# Altium schematic sheet UART Comm Isolation.SchDoc: UART Isolation
size 292 x 193 mm; SheetNumber: 7; SheetTotal: 12
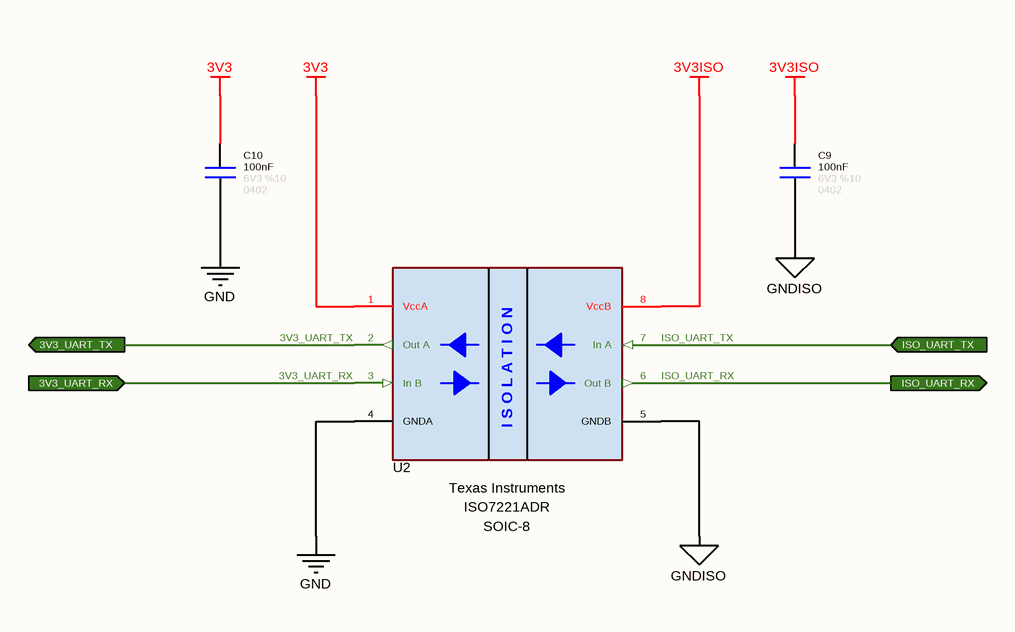
[diagram p0: UART Comm Isolation.SchDoc]

## Parts
C9  value 100nF  Tolerance: %10  Voltage: 6V3  Case: 0402  [CAPACITOR_0402]  (hidden comment: Capacitor - 100nF [0402] (Ceramic))
C10  value 100nF  Tolerance: %10  Voltage: 6V3  Case: 0402  [CAPACITOR_0402]  (hidden comment: Capacitor - 100nF [0402] (Ceramic))
U2  Manufacturer Name: Texas Instruments  Case: SOIC-8  [SOIC-8 Narrow]  (hidden comment: ISO7221ADR)

## Ports
3V3_UART_RX (in), 3V3_UART_TX (out), ISO_UART_RX (out), ISO_UART_TX (in)

## Nets
3V3: C10.2 U2.1(VccA)
3V3ISO: C9.2 U2.8(VccB)
GND: C10.1 U2.4(GNDA)
GNDISO: C9.1 U2.5(GNDB)
3V3_UART_RX: U2.3(In_B) ; port 3V3_UART_RX
3V3_UART_TX: U2.2(Out_A) ; port 3V3_UART_TX
ISO_UART_RX: U2.6(Out_B) ; port ISO_UART_RX
ISO_UART_TX: U2.7(In_A) ; port ISO_UART_TX

## Notes on the sheet
- © 2021 All rights reserved.
  This document may not, in whole or in part, be copied, photocopied, reproduced, translated or converted to any electronic or machine readable from without prior written permission of Mehmet Günce Akkoyun.
  Engineer contact : akkoyun@me.com
- Property of
- Engineer :
- Date :
- Size :
- A4
- Time :
- Project :
- Page :
- /
- Customer :
- Product ID :
- Module ID :
- Version :
- File :
- Revision :
- (in symbol IC - ISO7221ADR) I S O L A T I O N

## Library data of the parts
C9 C10 = Capacitor - 100nF [0402-6V3]: Capacitor - 100nF [0402-6V3] (Ceramic); Manufacturer Name: AVX; Manufacturer Part Number: 04026D104KAT4A; ComponentLink1Description: Mouser; ComponentLink1URL: https://www.mouser.com.tr/ProductDetail/AVX/04026D104KAT4A?qs=sGAEpiMZZMs0AnBnWHyRQPg4iYkCw7IMED%2F4kpqgf7w%3D; ComponentLink2Description: DataSheet; ComponentLink2URL: https://www.mouser.com.tr/datasheet/2/40/cx5r-776519.pdf
U2 = IC - ISO7221ADR: Dual-channel, TTL, 1/1, 1-Mbps digital isolator 8-SOIC -40 to 125; Isolation Voltage: 2500 Vrms; Supply Voltage - Min: 3.3 V; Supply Voltage - Max: 5 V; Manufacturer Part Number: ISO7221ADR